# Altium schematic sheet HDMI Termination.SchDoc
size A3; SheetNumber: 9; SheetTotal: 11
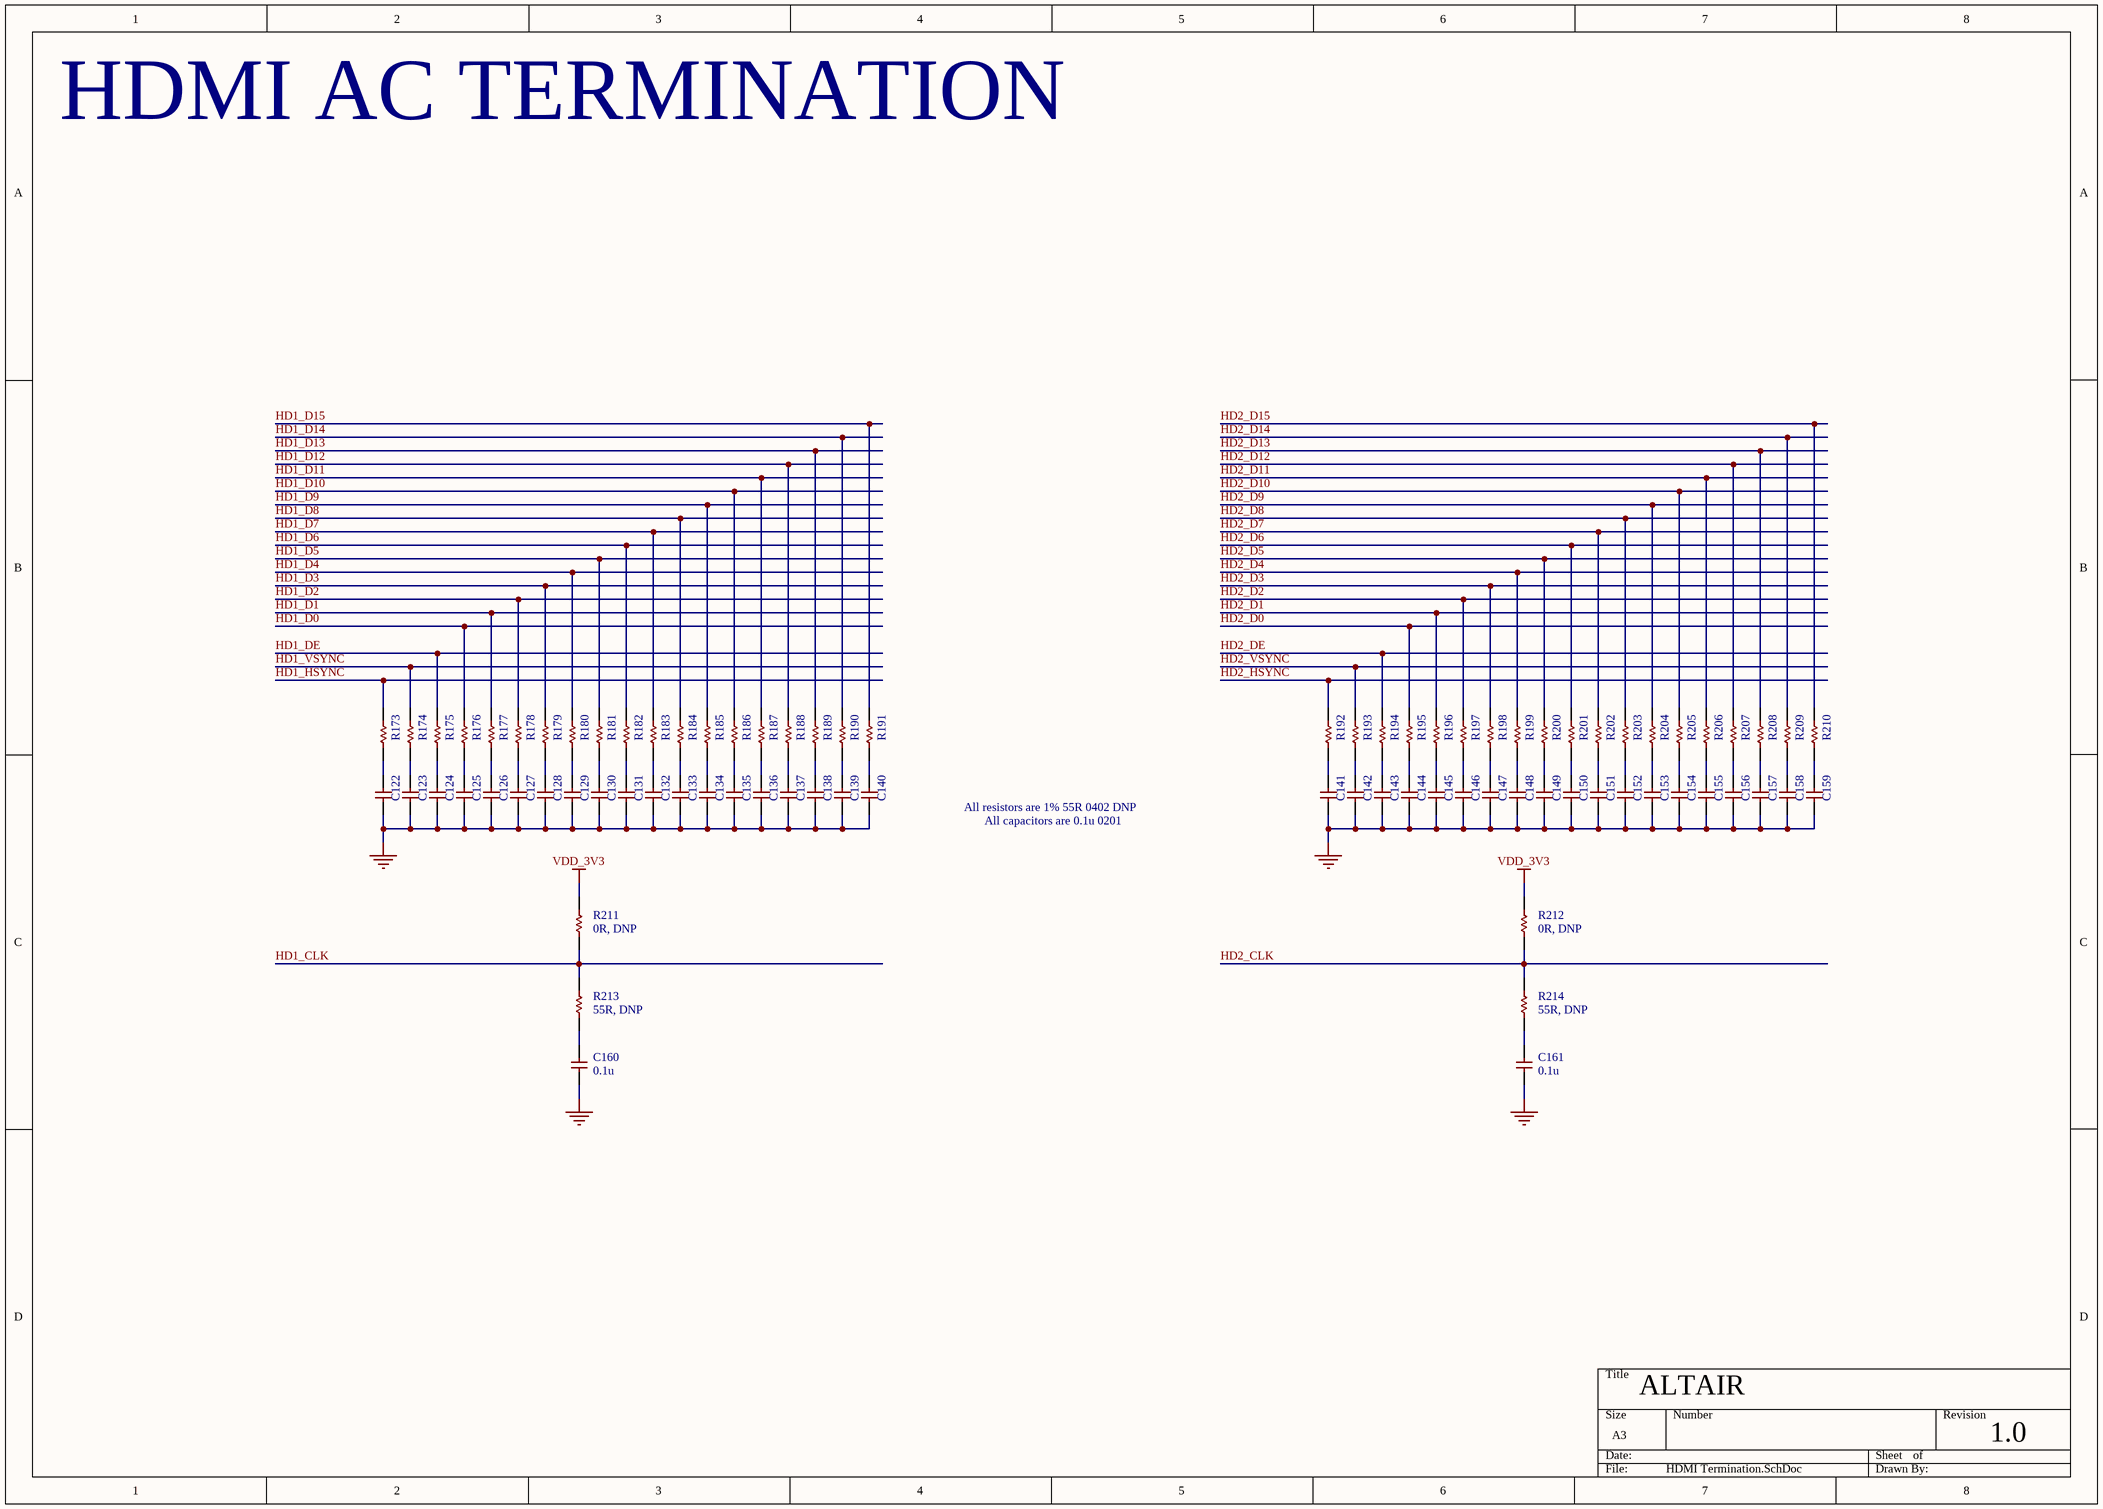
[diagram p0: HDMI Termination.SchDoc]

## Parts
C122  0.1u  [CAP_0201]  (value not drawn)
C123  0.1u  [CAP_0201]  (value not drawn)
C124  0.1u  [CAP_0201]  (value not drawn)
C125  0.1u  [CAP_0201]  (value not drawn)
C126  0.1u  [CAP_0201]  (value not drawn)
C127  0.1u  [CAP_0201]  (value not drawn)
C128  0.1u  [CAP_0201]  (value not drawn)
C129  0.1u  [CAP_0201]  (value not drawn)
C130  0.1u  [CAP_0201]  (value not drawn)
C131  0.1u  [CAP_0201]  (value not drawn)
C132  0.1u  [CAP_0201]  (value not drawn)
C133  0.1u  [CAP_0201]  (value not drawn)
C134  0.1u  [CAP_0201]  (value not drawn)
C135  0.1u  [CAP_0201]  (value not drawn)
C136  0.1u  [CAP_0201]  (value not drawn)
C137  0.1u  [CAP_0201]  (value not drawn)
C138  0.1u  [CAP_0201]  (value not drawn)
C139  0.1u  [CAP_0201]  (value not drawn)
C140  0.1u  [CAP_0201]  (value not drawn)
C141  0.1u  [CAP_0201]  (value not drawn)
C142  0.1u  [CAP_0201]  (value not drawn)
C143  0.1u  [CAP_0201]  (value not drawn)
C144  0.1u  [CAP_0201]  (value not drawn)
C145  0.1u  [CAP_0201]  (value not drawn)
C146  0.1u  [CAP_0201]  (value not drawn)
C147  0.1u  [CAP_0201]  (value not drawn)
C148  0.1u  [CAP_0201]  (value not drawn)
C149  0.1u  [CAP_0201]  (value not drawn)
C150  0.1u  [CAP_0201]  (value not drawn)
C151  0.1u  [CAP_0201]  (value not drawn)
C152  0.1u  [CAP_0201]  (value not drawn)
C153  0.1u  [CAP_0201]  (value not drawn)
C154  0.1u  [CAP_0201]  (value not drawn)
C155  0.1u  [CAP_0201]  (value not drawn)
C156  0.1u  [CAP_0201]  (value not drawn)
C157  0.1u  [CAP_0201]  (value not drawn)
C158  0.1u  [CAP_0201]  (value not drawn)
C159  0.1u  [CAP_0201]  (value not drawn)
C160  0.1u  [CAP_0201]
C161  0.1u  [CAP_0201]
R173  0R, DNP  [RES_0402]  (value not drawn)
R174  0R, DNP  [RES_0402]  (value not drawn)
R175  0R, DNP  [RES_0402]  (value not drawn)
R176  0R, DNP  [RES_0402]  (value not drawn)
R177  0R, DNP  [RES_0402]  (value not drawn)
R178  0R, DNP  [RES_0402]  (value not drawn)
R179  0R, DNP  [RES_0402]  (value not drawn)
R180  0R, DNP  [RES_0402]  (value not drawn)
R181  0R, DNP  [RES_0402]  (value not drawn)
R182  0R, DNP  [RES_0402]  (value not drawn)
R183  0R, DNP  [RES_0402]  (value not drawn)
R184  0R, DNP  [RES_0402]  (value not drawn)
R185  0R, DNP  [RES_0402]  (value not drawn)
R186  0R, DNP  [RES_0402]  (value not drawn)
R187  0R, DNP  [RES_0402]  (value not drawn)
R188  0R, DNP  [RES_0402]  (value not drawn)
R189  0R, DNP  [RES_0402]  (value not drawn)
R190  0R, DNP  [RES_0402]  (value not drawn)
R191  0R, DNP  [RES_0402]  (value not drawn)
R192  0R, DNP  [RES_0402]  (value not drawn)
R193  0R, DNP  [RES_0402]  (value not drawn)
R194  0R, DNP  [RES_0402]  (value not drawn)
R195  0R, DNP  [RES_0402]  (value not drawn)
R196  0R, DNP  [RES_0402]  (value not drawn)
R197  0R, DNP  [RES_0402]  (value not drawn)
R198  0R, DNP  [RES_0402]  (value not drawn)
R199  0R, DNP  [RES_0402]  (value not drawn)
R200  0R, DNP  [RES_0402]  (value not drawn)
R201  0R, DNP  [RES_0402]  (value not drawn)
R202  0R, DNP  [RES_0402]  (value not drawn)
R203  0R, DNP  [RES_0402]  (value not drawn)
R204  0R, DNP  [RES_0402]  (value not drawn)
R205  0R, DNP  [RES_0402]  (value not drawn)
R206  0R, DNP  [RES_0402]  (value not drawn)
R207  0R, DNP  [RES_0402]  (value not drawn)
R208  0R, DNP  [RES_0402]  (value not drawn)
R209  0R, DNP  [RES_0402]  (value not drawn)
R210  0R, DNP  [RES_0402]  (value not drawn)
R211  0R, DNP  [RES_0402]
R212  0R, DNP  [RES_0402]
R213  55R, DNP  [RES_0402]
R214  55R, DNP  [RES_0402]

## Nets
GND: C122.1 C123.1 C124.1 C125.1 C126.1 C127.1 C128.1 C129.1 C130.1 C131.1 C132.1 C133.1 C134.1 C135.1 C136.1 C137.1 C138.1 C139.1 C140.1 C141.1 C142.1 C143.1 C144.1 C145.1 C146.1 C147.1 C148.1 C149.1 C150.1 C151.1 C152.1 C153.1 C154.1 C155.1 C156.1 C157.1 C158.1 C159.1 C160.1 C161.1
VDD_3V3: R211.2 R212.2
HD1_CLK: R211.1 R213.2
HD1_D0: R176.2
HD1_D1: R177.2
HD1_D2: R178.2
HD1_D3: R179.2
HD1_D4: R180.2
HD1_D5: R181.2
HD1_D6: R182.2
HD1_D7: R183.2
HD1_D8: R184.2
HD1_D9: R185.2
HD1_D10: R186.2
HD1_D11: R187.2
HD1_D12: R188.2
HD1_D13: R189.2
HD1_D14: R190.2
HD1_D15: R191.2
HD1_DE: R175.2
HD1_HSYNC: R173.2
HD1_VSYNC: R174.2
HD2_CLK: R212.1 R214.2
HD2_D0: R195.2
HD2_D1: R196.2
HD2_D2: R197.2
HD2_D3: R198.2
HD2_D4: R199.2
HD2_D5: R200.2
HD2_D6: R201.2
HD2_D7: R202.2
HD2_D8: R203.2
HD2_D9: R204.2
HD2_D10: R205.2
HD2_D11: R206.2
HD2_D12: R207.2
HD2_D13: R208.2
HD2_D14: R209.2
HD2_D15: R210.2
HD2_DE: R194.2
HD2_HSYNC: R192.2
HD2_VSYNC: R193.2
NetC122_2: C122.2 R173.1
NetC123_2: C123.2 R174.1
NetC124_2: C124.2 R175.1
NetC125_2: C125.2 R176.1
NetC126_2: C126.2 R177.1
NetC127_2: C127.2 R178.1
NetC128_2: C128.2 R179.1
NetC129_2: C129.2 R180.1
NetC130_2: C130.2 R181.1
NetC131_2: C131.2 R182.1
NetC132_2: C132.2 R183.1
NetC133_2: C133.2 R184.1
NetC134_2: C134.2 R185.1
NetC135_2: C135.2 R186.1
NetC136_2: C136.2 R187.1
NetC137_2: C137.2 R188.1
NetC138_2: C138.2 R189.1
NetC139_2: C139.2 R190.1
NetC140_2: C140.2 R191.1
NetC141_2: C141.2 R192.1
NetC142_2: C142.2 R193.1
NetC143_2: C143.2 R194.1
NetC144_2: C144.2 R195.1
NetC145_2: C145.2 R196.1
NetC146_2: C146.2 R197.1
NetC147_2: C147.2 R198.1
NetC148_2: C148.2 R199.1
NetC149_2: C149.2 R200.1
NetC150_2: C150.2 R201.1
NetC151_2: C151.2 R202.1
NetC152_2: C152.2 R203.1
NetC153_2: C153.2 R204.1
NetC154_2: C154.2 R205.1
NetC155_2: C155.2 R206.1
NetC156_2: C156.2 R207.1
NetC157_2: C157.2 R208.1
NetC158_2: C158.2 R209.1
NetC159_2: C159.2 R210.1
NetC160_2: C160.2 R213.1
NetC161_2: C161.2 R214.1

## Notes on the sheet
- HDMI AC TERMINATION
- All resistors are 1% 55R 0402 DNP
- All capacitors are 0.1u 0201
- ALTAIR
- 1.0

## Library data of the parts
C122-C161 = CAP_0201: Capacitor SMD 0201; Part No: CL03A104KP3NNNC; LCSC: *; JLCPCB Part #: C49062; Footprint JLCPCB: 0201
R173-R212 = RES_0402: Resistor SMD 0402; Part No: RC0402JR-070RL; LCSC: *; Note/Misc: DNP; JLCPCB Part #: C60485; Footprint JLCPCB: 0402
R213 R214 = RES_0402: Resistor SMD 0402; LCSC: *; JLCPCB Part #: *; Footprint JLCPCB: *